# EAGLE design Breakout_10Pin (EAGLE 9.6.2)
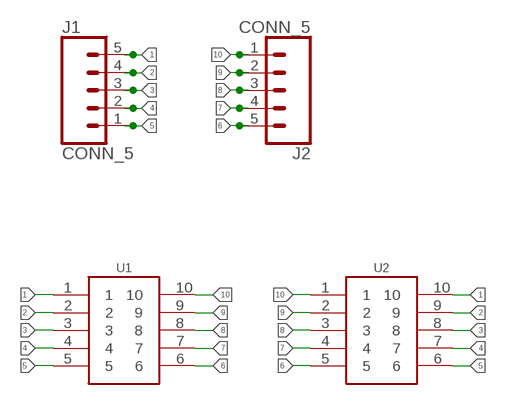
[diagram p0: schematic, sheet 1]

## Parts
J1  CONN_5  [1X05]
J2  CONN_5  [1X05]
U1  GEN_10SOIC10  [SO10]
U2  GEN_10VSSOP10  [VSSOP_10]

## Nets
1: J1.5 U1.1 U2.10
2: J1.4 U1.2 U2.9
3: J1.3 U1.3 U2.8
4: J1.2 U1.4 U2.7
5: J1.1 U1.5 U2.6
6: J2.5 U1.6 U2.5
7: J2.4 U1.7 U2.4
8: J2.3 U1.8 U2.3
9: J2.2 U1.9 U2.2
10: J2.1 U1.10 U2.1

## Library data of the parts
J1 J2 = bschulz:CONN_5: Genaric 5 terminal header
U1 U2 = bschulz:GEN_10: Generic 10 Pin Package for Breakout Boards

## Board
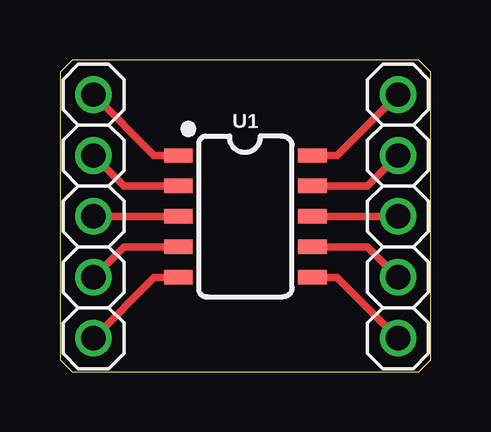
[diagram p1: board, top side]
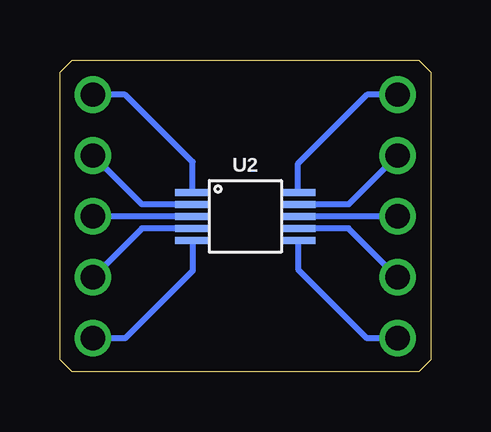
[diagram p2: board, bottom side, seen from below]

Size 15.47 x 13 mm. Coordinates in mm from the lower left corner, seen from the top.
Outline: 0.5,0 14.97,0 15.47,0.5 15.47,12.5 14.97,13 0.5,13 0,12.5 0,0.5 0.5,0
Copper layers (1*16): Top 0.035559375mm / dielectric 1.6mm / Bottom 0.035559375mm
Design rules "oshpark-2layer": minimum track width 6mil, minimum drill 10mil, track to track 6mil, track to pad 6mil, pad to pad 6mil, via to via 6mil, smd to smd 6mil, copper to edge 15mil, drill to drill 6mil, minimum pad ring 5mil, minimum via ring 5mil, stop-mask expansion 2.5mil, vias tented up to drill 0mil, thermal gap 10mil

### Footprints (pad centres in the part's own frame; a part is rotated, then mirrored left to right if it is on the bottom)
1X05 = drill 1.016: 1 -5.08,0; 2 -2.54,0; 3 0,0; 4 2.54,0; 5 5.08,0
SO10 = smd 0.6 x 1.2: 1 -2.54,-2.8; 2 -1.27,-2.8; 3 0,-2.8; 4 1.27,-2.8; 5 2.54,-2.8; 6 2.54,2.8; 7 1.27,2.8; 8 0,2.8; 9 -1.27,2.8; 10 -2.54,2.8
VSSOP_10 = smd 0.3 x 1.45: 1 -1,-2.2; 2 -0.5,-2.2; 3 0,-2.2; 4 0.5,-2.2; 5 1,-2.2; 6 1,2.2; 7 0.5,2.2; 8 0,2.2; 9 -0.5,2.2; 10 -1,2.2

### Placement (x,y rotation side)
J1  1.4,6.48 90 top
J2  14.1,6.48 270 top
U1  7.74,6.48 270 top
U2  7.74,6.48 270 bottom

### Tracks (layer width: path | path; a pad name or v marks a point on that pad's centre or on a via)
1
  Top 0.305: J1.5 3.94,9.02 U1.1
  Bottom 0.254: J1.5 2.67,11.56 5.54,8.69 U2.10
2
  Top 0.305: J1.4 2.67,7.75 U1.2
  Bottom 0.254: J1.4 3.44,6.98 U2.9
3
  Top 0.305: J1.3 U1.3
  Bottom 0.254: J1.3 U2.8
4
  Top 0.305: J1.2 2.67,5.21 U1.4
  Bottom 0.254: J1.2 3.44,5.98 U2.7
5
  Top 0.305: J1.1 3.94,3.94 U1.5
  Bottom 0.254: J1.1 2.67,1.4 5.54,4.27 U2.6
6
  Top 0.305: J2.5 11.56,3.94 U1.6
  Bottom 0.254: U2.5 9.94,4.21 12.75,1.4 J2.5
7
  Top 0.305: J2.4 12.83,5.21 U1.7
  Bottom 0.254: U2.4 12.06,5.98 J2.4
8
  Top 0.305: J2.3 U1.8
  Bottom 0.254: U2.3 J2.3
9
  Top 0.305: U1.9 12.83,7.75 J2.2
  Bottom 0.254: U2.2 12.06,6.98 J2.2
10
  Top 0.305: J2.1 11.56,9.02 U1.10
  Bottom 0.254: U2.1 9.94,8.75 12.75,11.56 J2.1

### Text on the board
tDocu: SOIC 10 | 1 | 10 | 2 | 9 | 3 | 8 | 4 | 7 | 5 | 6 | Bobby Schulz / Break44
bDocu: SSOP-10 | 10 | 1 | 9 | 2 | 8 | 3 | 7 | 4 | 6 | 5